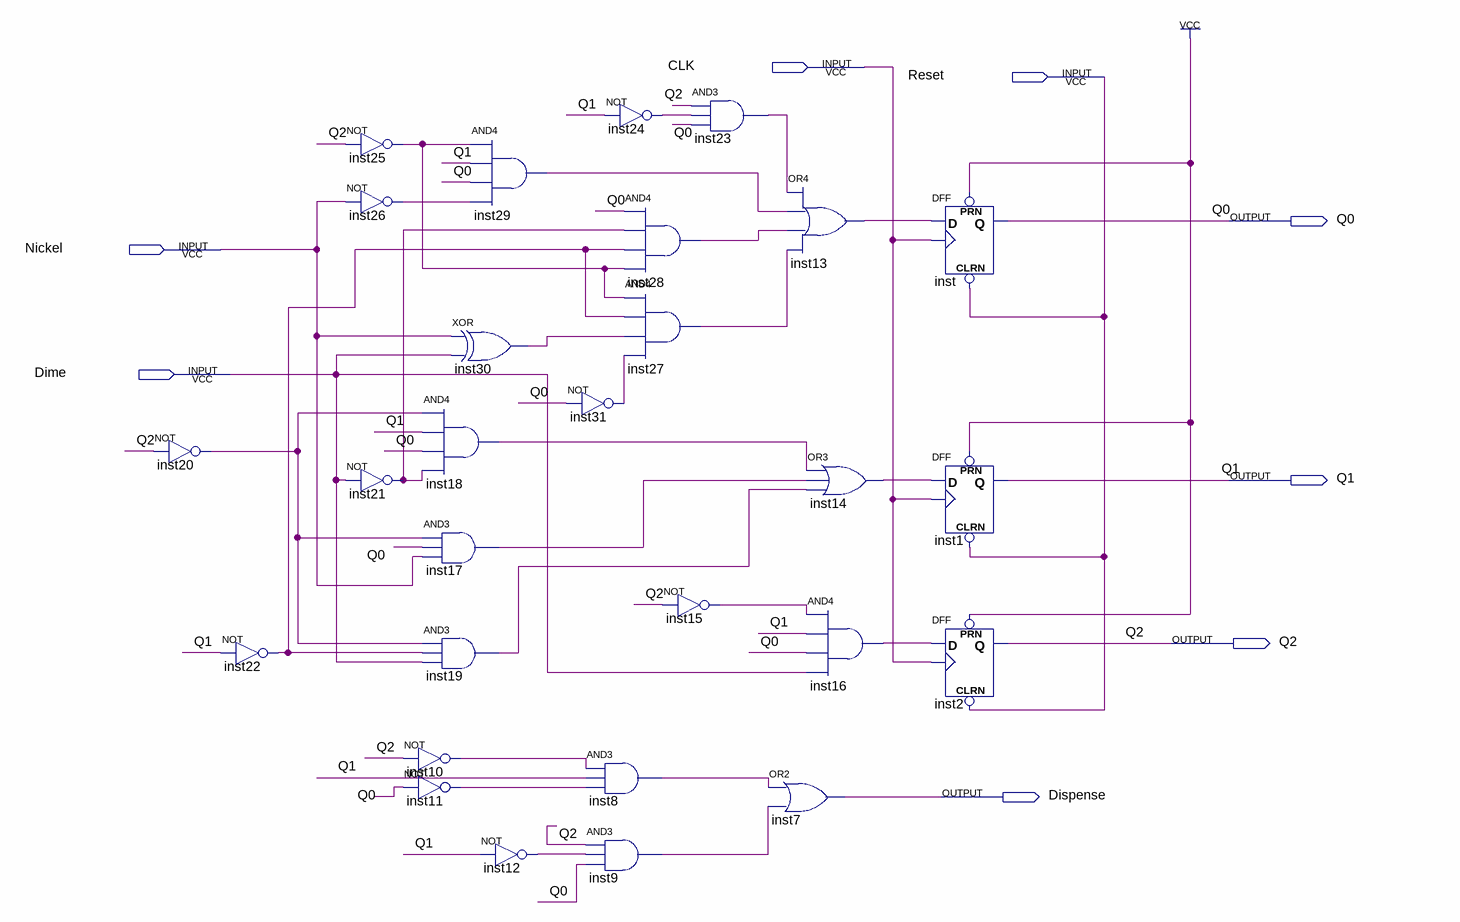
[diagram p0: schematic sheet]
// Quartus schematic vendblock.bdf as structural Verilog: 28 symbols, 8 pins
module vendblock (
  input  CLK,
  input  Reset,
  input  Nickel,
  input  Dime,
  output Q0,
  output Q1,
  output Q2,
  output Dispense
);

  wire inst8_out, inst9_out, inst10_out, inst11_out, inst12_out, inst13_out, inst14_out, inst15_out,
       inst16_out, inst17_out, inst18_out, inst19_out, inst20_out, inst21_out, inst22_out, inst23_out,
       inst24_out, inst25_out, inst26_out, inst27_out, inst28_out, inst29_out, inst30_out, inst31_out;

  not inst20 (inst20_out, Q2);
  not inst22 (inst22_out, Q1);
  not inst25 (inst25_out, Q2);
  not inst26 (inst26_out, Nickel);
  not inst21 (inst21_out, Dime);
  xor inst30 (inst30_out, Nickel, Dime);
  and inst18 (inst18_out, inst20_out, Q1, Q0, inst21_out);
  and inst17 (inst17_out, inst20_out, Q0, Nickel);
  and inst19 (inst19_out, inst20_out, inst22_out, Dime);
  not inst10 (inst10_out, Q2);
  not inst11 (inst11_out, Q0);
  and inst29 (inst29_out, inst25_out, Q1, Q0, inst26_out);
  not inst12 (inst12_out, Q1);
  not inst24 (inst24_out, Q1);
  not inst31 (inst31_out, Q0);
  and inst8 (inst8_out, inst10_out, Q1, inst11_out);
  and inst9 (inst9_out, Q2, inst12_out, Q0);
  and inst23 (inst23_out, Q2, inst24_out, Q0);
  and inst28 (inst28_out, Q0, inst21_out, inst22_out, inst25_out);
  and inst27 (inst27_out, inst25_out, inst22_out, inst30_out, inst31_out);
  not inst15 (inst15_out, Q2);
  or inst7 (Dispense, inst8_out, inst9_out);
  or inst13 (inst13_out, inst23_out, inst29_out, inst28_out, inst27_out);
  or inst14 (inst14_out, inst18_out, inst17_out, inst19_out);
  and inst16 (inst16_out, inst15_out, Q1, Q0, Dime);
  DFF inst (.CLRN(Reset), .CLK(CLK), .D(inst13_out), .PRN(1'b1), .Q(Q0));
  DFF inst1 (.CLRN(Reset), .CLK(CLK), .D(inst14_out), .PRN(1'b1), .Q(Q1));
  DFF inst2 (.CLRN(Reset), .CLK(CLK), .D(inst16_out), .PRN(1'b1), .Q(Q2));
endmodule
